# Altium schematic sheet BLOCKS.SchDoc
size A2; SheetNumber: 2; SheetTotal: 21
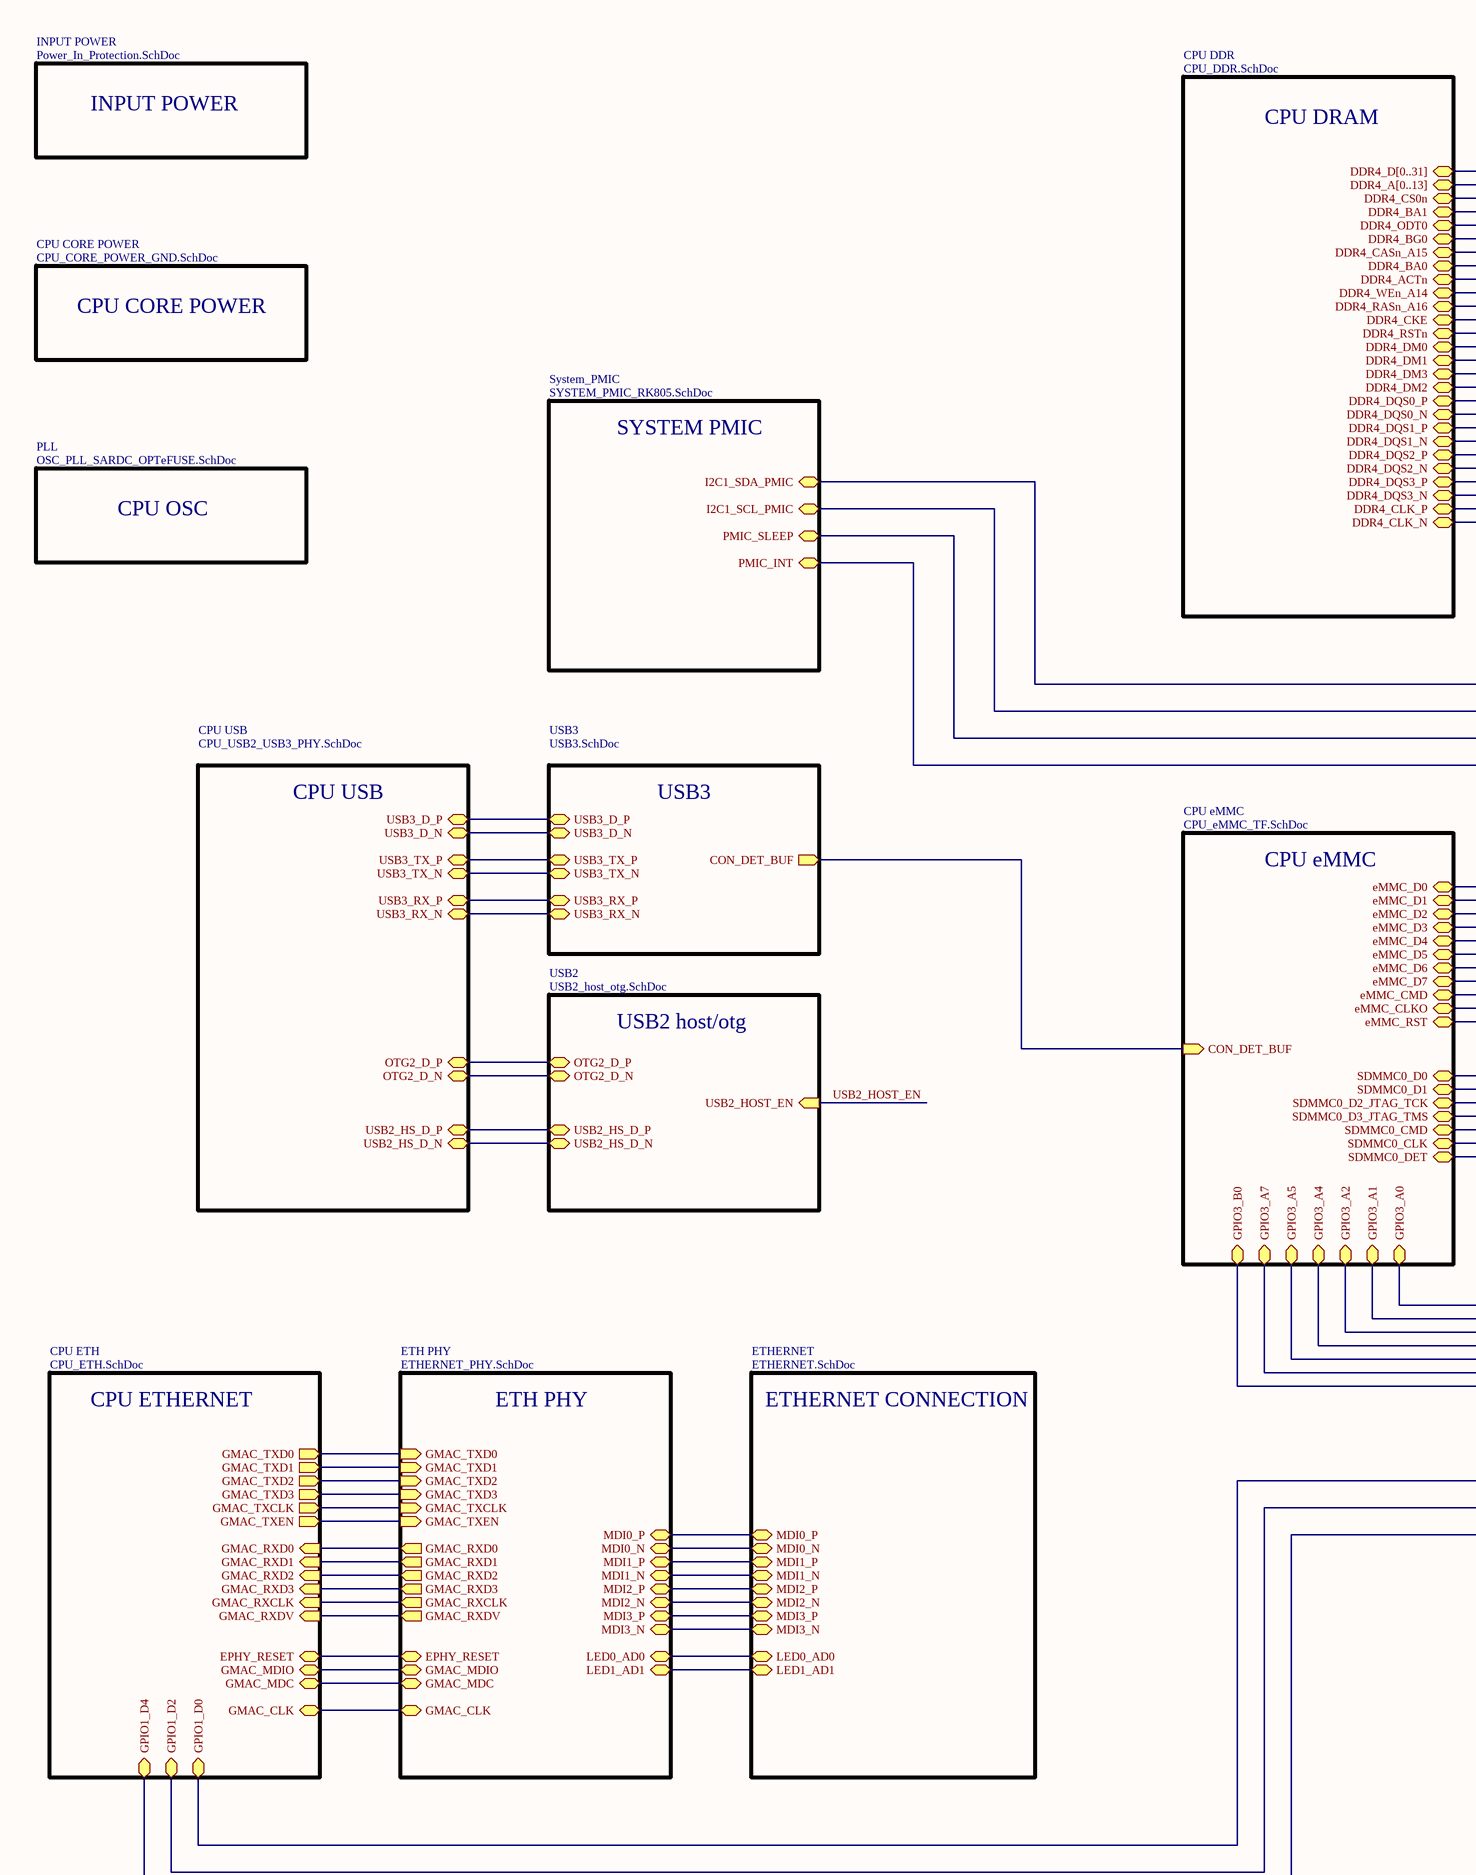
[diagram p0: BLOCKS.SchDoc, left]
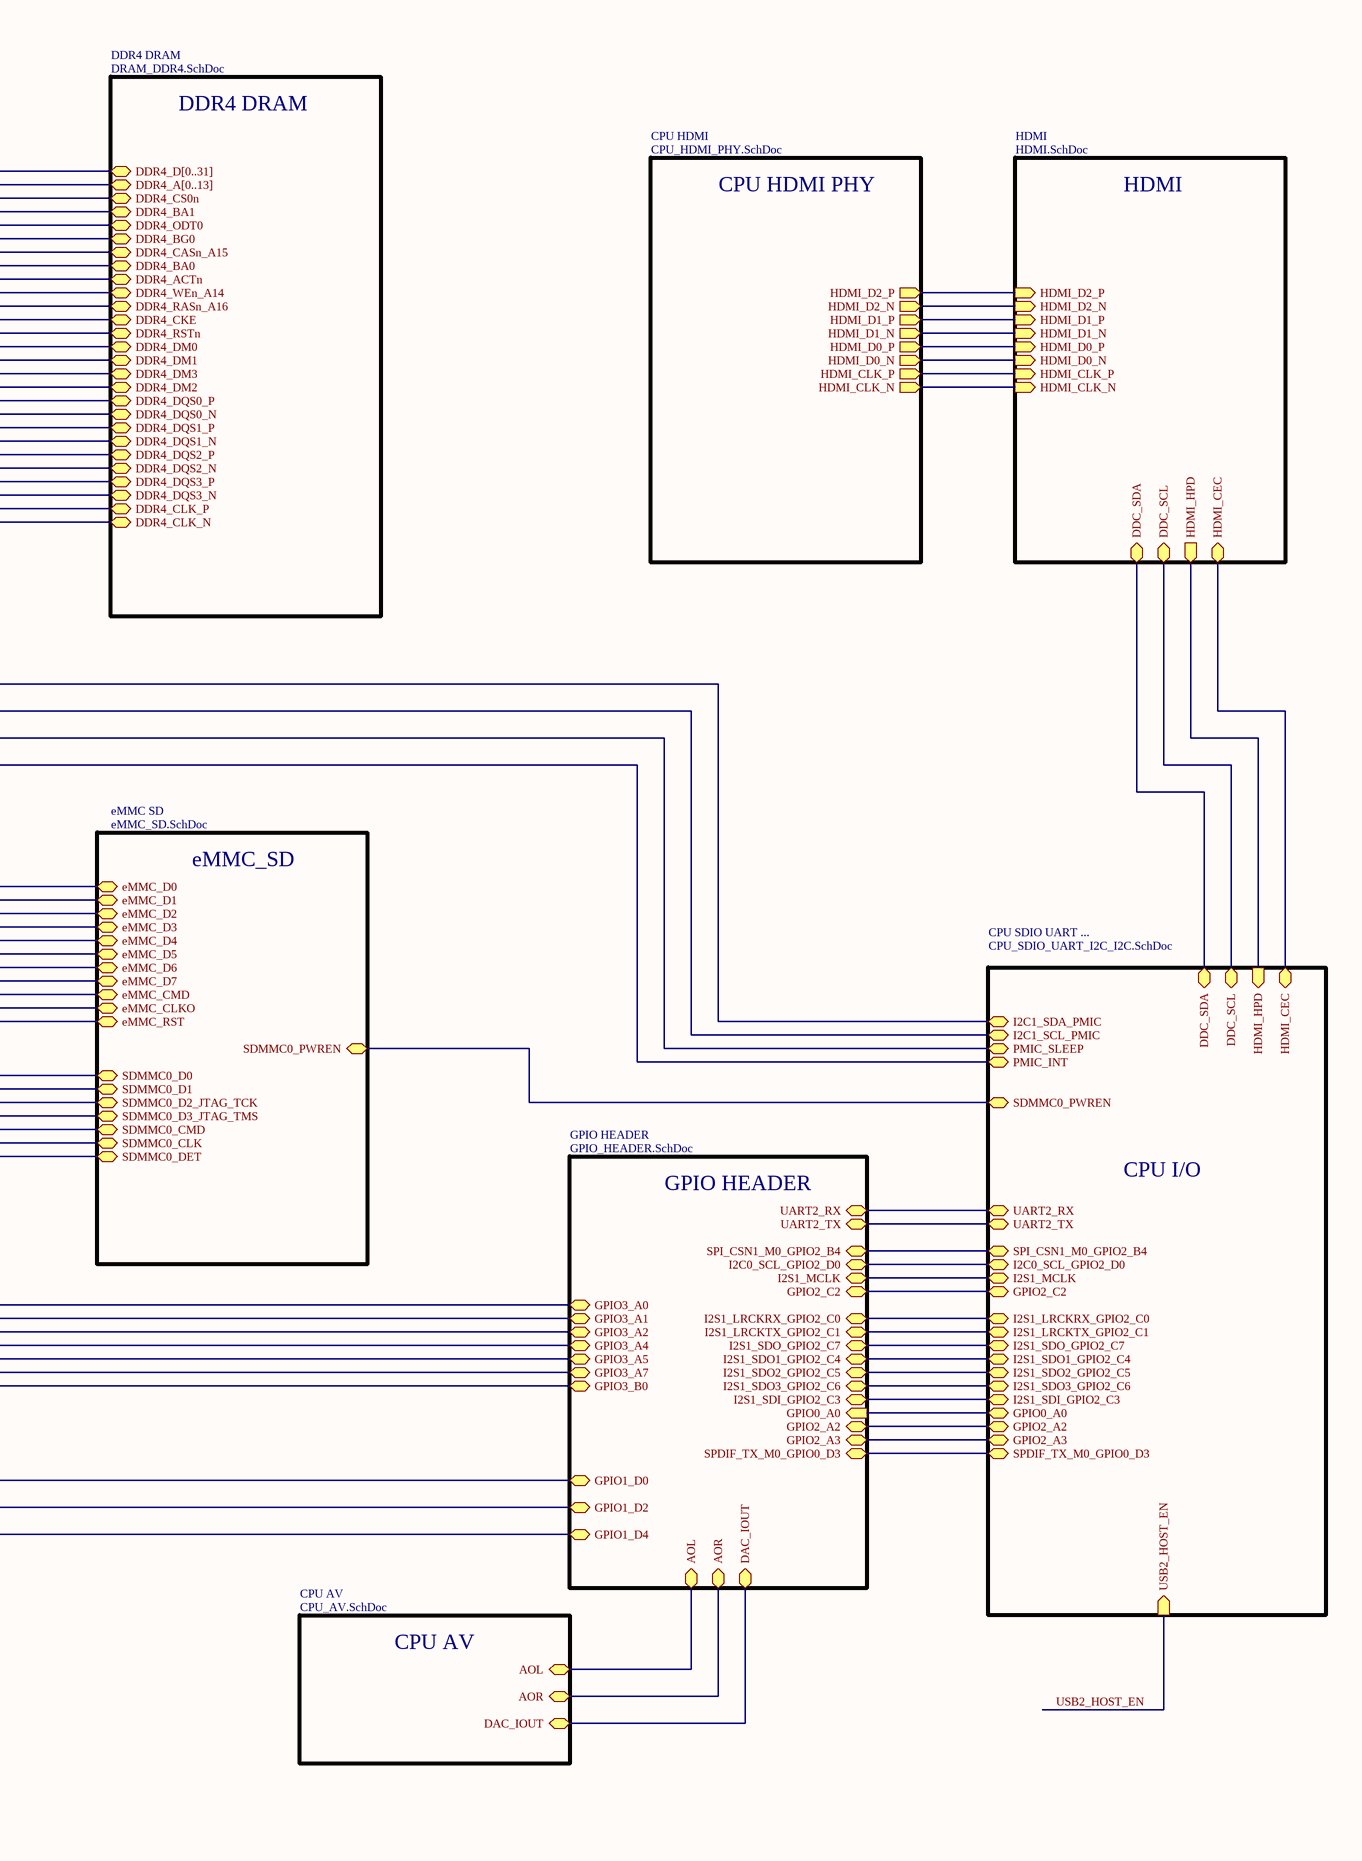
[diagram p1: BLOCKS.SchDoc, right]

## Sub-sheets
CPU AV = CPU_AV.SchDoc: AOL (bidir), AOR (bidir), DAC_IOUT (bidir)
CPU CORE POWER = CPU_CORE_POWER_GND.SchDoc: no entries
CPU DDR = CPU_DDR.SchDoc: DDR4_D[0..31] (bidir), DDR4_A[0..13] (bidir), DDR4_CS0n (bidir), DDR4_BA1 (bidir), DDR4_ODT0 (bidir), DDR4_BG0 (bidir), DDR4_CASn_A15 (bidir), DDR4_BA0 (bidir), DDR4_ACTn (bidir), DDR4_WEn_A14 (bidir), DDR4_RASn_A16 (bidir), DDR4_CKE (bidir), DDR4_RSTn (bidir), DDR4_DM0 (bidir), DDR4_DM1 (bidir), DDR4_DM3 (bidir), DDR4_DM2 (bidir), DDR4_DQS0_P (bidir), DDR4_DQS0_N (bidir), DDR4_DQS1_P (bidir), DDR4_DQS1_N (bidir), DDR4_DQS2_P (bidir), DDR4_DQS2_N (bidir), DDR4_DQS3_P (bidir), DDR4_DQS3_N (bidir), DDR4_CLK_P (bidir), DDR4_CLK_N (bidir)
CPU eMMC = CPU_eMMC_TF.SchDoc: GPIO3_A4 (bidir), GPIO3_A5 (bidir), GPIO3_A7 (bidir), GPIO3_A0 (bidir), GPIO3_A2 (bidir), GPIO3_A1 (bidir), GPIO3_B0 (bidir), CON_DET_BUF (in), eMMC_D0 (bidir), eMMC_D1 (bidir), eMMC_D2 (bidir), eMMC_D3 (bidir), eMMC_D4 (bidir), eMMC_D5 (bidir), eMMC_D6 (bidir), eMMC_D7 (bidir), eMMC_CMD (bidir), eMMC_CLKO (bidir), eMMC_RST (bidir), SDMMC0_D0 (bidir), SDMMC0_D1 (bidir), SDMMC0_D2_JTAG_TCK (bidir), SDMMC0_D3_JTAG_TMS (bidir), SDMMC0_CMD (bidir), SDMMC0_CLK (bidir), SDMMC0_DET (bidir)
CPU ETH = CPU_ETH.SchDoc: GMAC_TXD1 (out), GMAC_TXD0 (out), GMAC_TXCLK (out), GMAC_TXD2 (out), GMAC_TXD3 (out), GMAC_TXEN (out), GMAC_RXD1 (in), GMAC_RXD0 (in), GMAC_RXD2 (in), GMAC_RXD3 (in), GMAC_RXCLK (in), GMAC_RXDV (in), GMAC_CLK (bidir), EPHY_RESET (bidir), GMAC_MDIO (bidir), GMAC_MDC (bidir), GPIO1_D2 (bidir), GPIO1_D4 (bidir), GPIO1_D0 (bidir)
CPU HDMI = CPU_HDMI_PHY.SchDoc: HDMI_D2_P (out), HDMI_D2_N (out), HDMI_D1_P (out), HDMI_D1_N (out), HDMI_D0_P (out), HDMI_D0_N (out), HDMI_CLK_P (out), HDMI_CLK_N (out)
CPU SDIO UART ... = CPU_SDIO_UART_I2C_I2C.SchDoc: HDMI_HPD (in), HDMI_CEC (bidir), DDC_SDA (bidir), I2C1_SDA_PMIC (bidir), I2C1_SCL_PMIC (bidir), PMIC_SLEEP (bidir), PMIC_INT (bidir), UART2_RX (bidir), UART2_TX (bidir), SPI_CSN1_M0_GPIO2_B4 (bidir), GPIO2_A3 (bidir), I2C0_SCL_GPIO2_D0 (bidir), I2S1_MCLK (bidir), GPIO2_C2 (bidir), I2S1_LRCKTX_GPIO2_C1 (bidir), I2S1_LRCKRX_GPIO2_C0 (bidir), I2S1_SDO_GPIO2_C7 (bidir), I2S1_SDO1_GPIO2_C4 (bidir), I2S1_SDO2_GPIO2_C5 (bidir), I2S1_SDO3_GPIO2_C6 (bidir), I2S1_SDI_GPIO2_C3 (bidir), USB2_HOST_EN (in), GPIO2_A2 (bidir), SPDIF_TX_M0_GPIO0_D3 (bidir), SDMMC0_PWREN (bidir), DDC_SCL (bidir), GPIO0_A0 (bidir)
CPU USB = CPU_USB2_USB3_PHY.SchDoc: USB3_D_P (bidir), USB3_D_N (bidir), USB3_RX_P (bidir), USB3_RX_N (bidir), USB3_TX_P (bidir), USB3_TX_N (bidir), OTG2_D_N (bidir), OTG2_D_P (bidir), USB2_HS_D_N (bidir), USB2_HS_D_P (bidir)
DDR4 DRAM = DRAM_DDR4.SchDoc: DDR4_D[0..31] (bidir), DDR4_A[0..13] (bidir), DDR4_CS0n (bidir), DDR4_BA1 (bidir), DDR4_ODT0 (bidir), DDR4_BG0 (bidir), DDR4_CASn_A15 (bidir), DDR4_BA0 (bidir), DDR4_ACTn (bidir), DDR4_WEn_A14 (bidir), DDR4_RASn_A16 (bidir), DDR4_CKE (bidir), DDR4_RSTn (bidir), DDR4_DM0 (bidir), DDR4_DM1 (bidir), DDR4_DM3 (bidir), DDR4_DM2 (bidir), DDR4_DQS0_P (bidir), DDR4_DQS0_N (bidir), DDR4_DQS1_P (bidir), DDR4_DQS1_N (bidir), DDR4_DQS2_P (bidir), DDR4_DQS2_N (bidir), DDR4_DQS3_P (bidir), DDR4_DQS3_N (bidir), DDR4_CLK_P (bidir), DDR4_CLK_N (bidir)
eMMC SD = eMMC_SD.SchDoc: eMMC_D1 (bidir), eMMC_D2 (bidir), eMMC_D3 (bidir), eMMC_D4 (bidir), eMMC_D5 (bidir), eMMC_D6 (bidir), eMMC_D7 (bidir), eMMC_D0 (bidir), eMMC_CLKO (bidir), eMMC_CMD (bidir), eMMC_RST (bidir), SDMMC0_PWREN (bidir), SDMMC0_D0 (bidir), SDMMC0_D1 (bidir), SDMMC0_D2_JTAG_TCK (bidir), SDMMC0_D3_JTAG_TMS (bidir), SDMMC0_CMD (bidir), SDMMC0_CLK (bidir), SDMMC0_DET (bidir)
ETH PHY = ETHERNET_PHY.SchDoc: GMAC_MDIO (bidir), GMAC_MDC (bidir), GMAC_RXD0 (out), GMAC_RXD1 (out), GMAC_RXD2 (out), GMAC_RXD3 (out), GMAC_RXCLK (out), GMAC_RXDV (out), GMAC_TXD0 (in), GMAC_TXD1 (in), GMAC_TXD2 (in), GMAC_TXD3 (in), GMAC_TXEN (in), GMAC_TXCLK (in), GMAC_CLK (bidir), EPHY_RESET (bidir), MDI0_P (bidir), MDI0_N (bidir), MDI1_P (bidir), MDI1_N (bidir), MDI2_P (bidir), MDI2_N (bidir), MDI3_P (bidir), MDI3_N (bidir), LED0_AD0 (bidir), LED1_AD1 (bidir)
ETHERNET = ETHERNET.SchDoc: MDI0_P (bidir), MDI0_N (bidir), MDI1_P (bidir), MDI1_N (bidir), MDI2_P (bidir), MDI2_N (bidir), MDI3_P (bidir), MDI3_N (bidir), LED0_AD0 (bidir), LED1_AD1 (bidir)
GPIO HEADER = GPIO_HEADER.SchDoc: AOL (bidir), AOR (bidir), GPIO3_A4 (bidir), GPIO3_A5 (bidir), GPIO3_A0 (bidir), GPIO3_A2 (bidir), GPIO3_A1 (bidir), GPIO3_B0 (bidir), GPIO1_D2 (bidir), GPIO3_A7 (bidir), GPIO1_D4 (bidir), DAC_IOUT (bidir), GPIO1_D0 (bidir), UART2_RX (bidir), UART2_TX (bidir), SPI_CSN1_M0_GPIO2_B4 (bidir), I2S1_LRCKRX_GPIO2_C0 (bidir), I2S1_SDO_GPIO2_C7 (bidir), I2S1_SDO1_GPIO2_C4 (bidir), I2S1_SDO2_GPIO2_C5 (bidir), I2S1_SDI_GPIO2_C3 (bidir), GPIO0_A0 (in), I2S1_MCLK (bidir), GPIO2_A2 (bidir), GPIO2_C2 (bidir), SPDIF_TX_M0_GPIO0_D3 (bidir), GPIO2_A3 (bidir), I2S1_LRCKTX_GPIO2_C1 (bidir), I2S1_SDO3_GPIO2_C6 (bidir), I2C0_SCL_GPIO2_D0 (bidir)
HDMI = HDMI.SchDoc: HDMI_D2_P (in), HDMI_D2_N (in), HDMI_D1_P (in), HDMI_D1_N (in), HDMI_D0_P (in), HDMI_D0_N (in), HDMI_CLK_P (in), HDMI_CLK_N (in), HDMI_CEC (bidir), DDC_SDA (bidir), HDMI_HPD (out), DDC_SCL (bidir)
INPUT POWER = Power_In_Protection.SchDoc: no entries
PLL = OSC_PLL_SARDC_OPTeFUSE.SchDoc: no entries
System_PMIC = SYSTEM_PMIC_RK805.SchDoc: I2C1_SCL_PMIC (bidir), I2C1_SDA_PMIC (bidir), PMIC_SLEEP (bidir), PMIC_INT (bidir)
USB2 = USB2_host_otg.SchDoc: USB2_HOST_EN (in), OTG2_D_P (bidir), OTG2_D_N (bidir), USB2_HS_D_P (bidir), USB2_HS_D_N (bidir)
USB3 = USB3.SchDoc: CON_DET_BUF (out), USB3_D_P (bidir), USB3_D_N (bidir), USB3_TX_P (bidir), USB3_TX_N (bidir), USB3_RX_P (bidir), USB3_RX_N (bidir)

## Nets
USB2_HOST_EN: sheet USB2/USB2_HOST_EN, sheet CPU SDIO UART .../USB2_HOST_EN
(unnamed): sheet System_PMIC/I2C1_SCL_PMIC, sheet CPU SDIO UART .../I2C1_SCL_PMIC
(unnamed): sheet System_PMIC/I2C1_SDA_PMIC, sheet CPU SDIO UART .../I2C1_SDA_PMIC
(unnamed): sheet System_PMIC/PMIC_SLEEP, sheet CPU SDIO UART .../PMIC_SLEEP
(unnamed): sheet System_PMIC/PMIC_INT, sheet CPU SDIO UART .../PMIC_INT
(unnamed): sheet CPU DDR/DDR4_CS0n, sheet DDR4 DRAM/DDR4_CS0n
(unnamed): sheet CPU DDR/DDR4_BA1, sheet DDR4 DRAM/DDR4_BA1
(unnamed): sheet CPU DDR/DDR4_ODT0, sheet DDR4 DRAM/DDR4_ODT0
(unnamed): sheet CPU DDR/DDR4_BG0, sheet DDR4 DRAM/DDR4_BG0
(unnamed): sheet CPU DDR/DDR4_CASn_A15, sheet DDR4 DRAM/DDR4_CASn_A15
(unnamed): sheet CPU DDR/DDR4_BA0, sheet DDR4 DRAM/DDR4_BA0
(unnamed): sheet CPU DDR/DDR4_ACTn, sheet DDR4 DRAM/DDR4_ACTn
(unnamed): sheet CPU DDR/DDR4_WEn_A14, sheet DDR4 DRAM/DDR4_WEn_A14
(unnamed): sheet CPU DDR/DDR4_RASn_A16, sheet DDR4 DRAM/DDR4_RASn_A16
(unnamed): sheet CPU DDR/DDR4_CKE, sheet DDR4 DRAM/DDR4_CKE
(unnamed): sheet CPU DDR/DDR4_RSTn, sheet DDR4 DRAM/DDR4_RSTn
(unnamed): sheet CPU DDR/DDR4_DM0, sheet DDR4 DRAM/DDR4_DM0
(unnamed): sheet CPU DDR/DDR4_DM1, sheet DDR4 DRAM/DDR4_DM1
(unnamed): sheet CPU DDR/DDR4_DM3, sheet DDR4 DRAM/DDR4_DM3
(unnamed): sheet CPU DDR/DDR4_DM2, sheet DDR4 DRAM/DDR4_DM2
(unnamed): sheet CPU DDR/DDR4_DQS0_P, sheet DDR4 DRAM/DDR4_DQS0_P
(unnamed): sheet CPU DDR/DDR4_DQS0_N, sheet DDR4 DRAM/DDR4_DQS0_N
(unnamed): sheet CPU DDR/DDR4_DQS1_P, sheet DDR4 DRAM/DDR4_DQS1_P
(unnamed): sheet CPU DDR/DDR4_DQS1_N, sheet DDR4 DRAM/DDR4_DQS1_N
(unnamed): sheet CPU DDR/DDR4_DQS2_P, sheet DDR4 DRAM/DDR4_DQS2_P
(unnamed): sheet CPU DDR/DDR4_DQS2_N, sheet DDR4 DRAM/DDR4_DQS2_N
(unnamed): sheet CPU DDR/DDR4_DQS3_P, sheet DDR4 DRAM/DDR4_DQS3_P
(unnamed): sheet CPU DDR/DDR4_DQS3_N, sheet DDR4 DRAM/DDR4_DQS3_N
(unnamed): sheet CPU DDR/DDR4_CLK_P, sheet DDR4 DRAM/DDR4_CLK_P
(unnamed): sheet CPU DDR/DDR4_CLK_N, sheet DDR4 DRAM/DDR4_CLK_N
(unnamed): sheet CPU eMMC/GPIO3_A4, sheet GPIO HEADER/GPIO3_A4
(unnamed): sheet CPU eMMC/GPIO3_A5, sheet GPIO HEADER/GPIO3_A5
(unnamed): sheet CPU eMMC/GPIO3_A7, sheet GPIO HEADER/GPIO3_A7
(unnamed): sheet CPU eMMC/GPIO3_A0, sheet GPIO HEADER/GPIO3_A0
(unnamed): sheet CPU eMMC/GPIO3_A2, sheet GPIO HEADER/GPIO3_A2
(unnamed): sheet CPU eMMC/GPIO3_A1, sheet GPIO HEADER/GPIO3_A1
(unnamed): sheet CPU eMMC/GPIO3_B0, sheet GPIO HEADER/GPIO3_B0
(unnamed): sheet CPU eMMC/CON_DET_BUF, sheet USB3/CON_DET_BUF
(unnamed): sheet CPU eMMC/eMMC_D0, sheet eMMC SD/eMMC_D0
(unnamed): sheet CPU eMMC/eMMC_D1, sheet eMMC SD/eMMC_D1
(unnamed): sheet CPU eMMC/eMMC_D2, sheet eMMC SD/eMMC_D2
(unnamed): sheet CPU eMMC/eMMC_D3, sheet eMMC SD/eMMC_D3
(unnamed): sheet CPU eMMC/eMMC_D4, sheet eMMC SD/eMMC_D4
(unnamed): sheet CPU eMMC/eMMC_D5, sheet eMMC SD/eMMC_D5
(unnamed): sheet CPU eMMC/eMMC_D6, sheet eMMC SD/eMMC_D6
(unnamed): sheet CPU eMMC/eMMC_D7, sheet eMMC SD/eMMC_D7
(unnamed): sheet CPU eMMC/eMMC_CMD, sheet eMMC SD/eMMC_CMD
(unnamed): sheet CPU eMMC/eMMC_CLKO, sheet eMMC SD/eMMC_CLKO
(unnamed): sheet CPU eMMC/eMMC_RST, sheet eMMC SD/eMMC_RST
(unnamed): sheet CPU eMMC/SDMMC0_D0, sheet eMMC SD/SDMMC0_D0
(unnamed): sheet CPU eMMC/SDMMC0_D1, sheet eMMC SD/SDMMC0_D1
(unnamed): sheet CPU eMMC/SDMMC0_D2_JTAG_TCK, sheet eMMC SD/SDMMC0_D2_JTAG_TCK
(unnamed): sheet CPU eMMC/SDMMC0_D3_JTAG_TMS, sheet eMMC SD/SDMMC0_D3_JTAG_TMS
(unnamed): sheet CPU eMMC/SDMMC0_CMD, sheet eMMC SD/SDMMC0_CMD
(unnamed): sheet CPU eMMC/SDMMC0_CLK, sheet eMMC SD/SDMMC0_CLK
(unnamed): sheet CPU eMMC/SDMMC0_DET, sheet eMMC SD/SDMMC0_DET
(unnamed): sheet eMMC SD/SDMMC0_PWREN, sheet CPU SDIO UART .../SDMMC0_PWREN
(unnamed): sheet CPU USB/USB3_D_P, sheet USB3/USB3_D_P
(unnamed): sheet CPU USB/USB3_D_N, sheet USB3/USB3_D_N
(unnamed): sheet CPU USB/USB3_RX_P, sheet USB3/USB3_RX_P
(unnamed): sheet CPU USB/USB3_RX_N, sheet USB3/USB3_RX_N
(unnamed): sheet CPU USB/USB3_TX_P, sheet USB3/USB3_TX_P
(unnamed): sheet CPU USB/USB3_TX_N, sheet USB3/USB3_TX_N
(unnamed): sheet CPU USB/OTG2_D_N, sheet USB2/OTG2_D_N
(unnamed): sheet CPU USB/OTG2_D_P, sheet USB2/OTG2_D_P
(unnamed): sheet CPU USB/USB2_HS_D_N, sheet USB2/USB2_HS_D_N
(unnamed): sheet CPU USB/USB2_HS_D_P, sheet USB2/USB2_HS_D_P
(unnamed): sheet CPU HDMI/HDMI_D2_P, sheet HDMI/HDMI_D2_P
(unnamed): sheet CPU HDMI/HDMI_D2_N, sheet HDMI/HDMI_D2_N
(unnamed): sheet CPU HDMI/HDMI_D1_P, sheet HDMI/HDMI_D1_P
(unnamed): sheet CPU HDMI/HDMI_D1_N, sheet HDMI/HDMI_D1_N
(unnamed): sheet CPU HDMI/HDMI_D0_P, sheet HDMI/HDMI_D0_P
(unnamed): sheet CPU HDMI/HDMI_D0_N, sheet HDMI/HDMI_D0_N
(unnamed): sheet CPU HDMI/HDMI_CLK_P, sheet HDMI/HDMI_CLK_P
(unnamed): sheet CPU HDMI/HDMI_CLK_N, sheet HDMI/HDMI_CLK_N
(unnamed): sheet HDMI/HDMI_CEC, sheet CPU SDIO UART .../HDMI_CEC
(unnamed): sheet HDMI/DDC_SDA, sheet CPU SDIO UART .../DDC_SDA
(unnamed): sheet HDMI/HDMI_HPD, sheet CPU SDIO UART .../HDMI_HPD
(unnamed): sheet HDMI/DDC_SCL, sheet CPU SDIO UART .../DDC_SCL
(unnamed): sheet CPU ETH/GMAC_TXD1, sheet ETH PHY/GMAC_TXD1
(unnamed): sheet CPU ETH/GMAC_TXD0, sheet ETH PHY/GMAC_TXD0
(unnamed): sheet CPU ETH/GMAC_TXCLK, sheet ETH PHY/GMAC_TXCLK
(unnamed): sheet CPU ETH/GMAC_TXD2, sheet ETH PHY/GMAC_TXD2
(unnamed): sheet CPU ETH/GMAC_TXD3, sheet ETH PHY/GMAC_TXD3
(unnamed): sheet CPU ETH/GMAC_TXEN, sheet ETH PHY/GMAC_TXEN
(unnamed): sheet CPU ETH/GMAC_RXD1, sheet ETH PHY/GMAC_RXD1
(unnamed): sheet CPU ETH/GMAC_RXD0, sheet ETH PHY/GMAC_RXD0
(unnamed): sheet CPU ETH/GMAC_RXD2, sheet ETH PHY/GMAC_RXD2
(unnamed): sheet CPU ETH/GMAC_RXD3, sheet ETH PHY/GMAC_RXD3
(unnamed): sheet CPU ETH/GMAC_RXCLK, sheet ETH PHY/GMAC_RXCLK
(unnamed): sheet CPU ETH/GMAC_RXDV, sheet ETH PHY/GMAC_RXDV
(unnamed): sheet CPU ETH/GMAC_CLK, sheet ETH PHY/GMAC_CLK
(unnamed): sheet CPU ETH/EPHY_RESET, sheet ETH PHY/EPHY_RESET
(unnamed): sheet CPU ETH/GMAC_MDIO, sheet ETH PHY/GMAC_MDIO
(unnamed): sheet CPU ETH/GMAC_MDC, sheet ETH PHY/GMAC_MDC
(unnamed): sheet CPU ETH/GPIO1_D2, sheet GPIO HEADER/GPIO1_D2
(unnamed): sheet CPU ETH/GPIO1_D4, sheet GPIO HEADER/GPIO1_D4
(unnamed): sheet CPU ETH/GPIO1_D0, sheet GPIO HEADER/GPIO1_D0
(unnamed): sheet ETH PHY/MDI0_P, sheet ETHERNET/MDI0_P
(unnamed): sheet ETH PHY/MDI0_N, sheet ETHERNET/MDI0_N
(unnamed): sheet ETH PHY/MDI1_P, sheet ETHERNET/MDI1_P
(unnamed): sheet ETH PHY/MDI1_N, sheet ETHERNET/MDI1_N
(unnamed): sheet ETH PHY/MDI2_P, sheet ETHERNET/MDI2_P
(unnamed): sheet ETH PHY/MDI2_N, sheet ETHERNET/MDI2_N
(unnamed): sheet ETH PHY/MDI3_P, sheet ETHERNET/MDI3_P
(unnamed): sheet ETH PHY/MDI3_N, sheet ETHERNET/MDI3_N
(unnamed): sheet ETH PHY/LED0_AD0, sheet ETHERNET/LED0_AD0
(unnamed): sheet ETH PHY/LED1_AD1, sheet ETHERNET/LED1_AD1
(unnamed): sheet GPIO HEADER/AOL, sheet CPU AV/AOL
(unnamed): sheet GPIO HEADER/AOR, sheet CPU AV/AOR
(unnamed): sheet GPIO HEADER/DAC_IOUT, sheet CPU AV/DAC_IOUT
(unnamed): sheet GPIO HEADER/UART2_RX, sheet CPU SDIO UART .../UART2_RX
(unnamed): sheet GPIO HEADER/UART2_TX, sheet CPU SDIO UART .../UART2_TX
(unnamed): sheet GPIO HEADER/SPI_CSN1_M0_GPIO2_B4, sheet CPU SDIO UART .../SPI_CSN1_M0_GPIO2_B4
(unnamed): sheet GPIO HEADER/I2S1_LRCKRX_GPIO2_C0, sheet CPU SDIO UART .../I2S1_LRCKRX_GPIO2_C0
(unnamed): sheet GPIO HEADER/I2S1_SDO_GPIO2_C7, sheet CPU SDIO UART .../I2S1_SDO_GPIO2_C7
(unnamed): sheet GPIO HEADER/I2S1_SDO1_GPIO2_C4, sheet CPU SDIO UART .../I2S1_SDO1_GPIO2_C4
(unnamed): sheet GPIO HEADER/I2S1_SDO2_GPIO2_C5, sheet CPU SDIO UART .../I2S1_SDO2_GPIO2_C5
(unnamed): sheet GPIO HEADER/I2S1_SDI_GPIO2_C3, sheet CPU SDIO UART .../I2S1_SDI_GPIO2_C3
(unnamed): sheet GPIO HEADER/GPIO0_A0, sheet CPU SDIO UART .../GPIO0_A0
(unnamed): sheet GPIO HEADER/I2S1_MCLK, sheet CPU SDIO UART .../I2S1_MCLK
(unnamed): sheet GPIO HEADER/GPIO2_A2, sheet CPU SDIO UART .../GPIO2_A2
(unnamed): sheet GPIO HEADER/GPIO2_C2, sheet CPU SDIO UART .../GPIO2_C2
(unnamed): sheet GPIO HEADER/SPDIF_TX_M0_GPIO0_D3, sheet CPU SDIO UART .../SPDIF_TX_M0_GPIO0_D3
(unnamed): sheet GPIO HEADER/GPIO2_A3, sheet CPU SDIO UART .../GPIO2_A3
(unnamed): sheet GPIO HEADER/I2S1_LRCKTX_GPIO2_C1, sheet CPU SDIO UART .../I2S1_LRCKTX_GPIO2_C1
(unnamed): sheet GPIO HEADER/I2S1_SDO3_GPIO2_C6, sheet CPU SDIO UART .../I2S1_SDO3_GPIO2_C6
(unnamed): sheet GPIO HEADER/I2C0_SCL_GPIO2_D0, sheet CPU SDIO UART .../I2C0_SCL_GPIO2_D0

## Buses and harness runs
bus sheet CPU DDR/DDR4_A[0..13] = sheet DDR4 DRAM/DDR4_A[0..13]
bus sheet CPU DDR/DDR4_D[0..31] = sheet DDR4 DRAM/DDR4_D[0..31]

## Notes on the sheet
- INPUT POWER
- DDR4 DRAM
- CPU DRAM
- CPU HDMI PHY
- HDMI
- CPU CORE POWER
- SYSTEM PMIC
- CPU OSC
- CPU USB
- USB3
- CPU eMMC
- eMMC_SD
- USB2 host/otg
- GPIO HEADER
- CPU I/O
- CPU ETHERNET
- ETH PHY
- ETHERNET CONNECTION
- CPU AV